# EAGLE schematic SHIELD 003 (EAGLE 9.4.1)
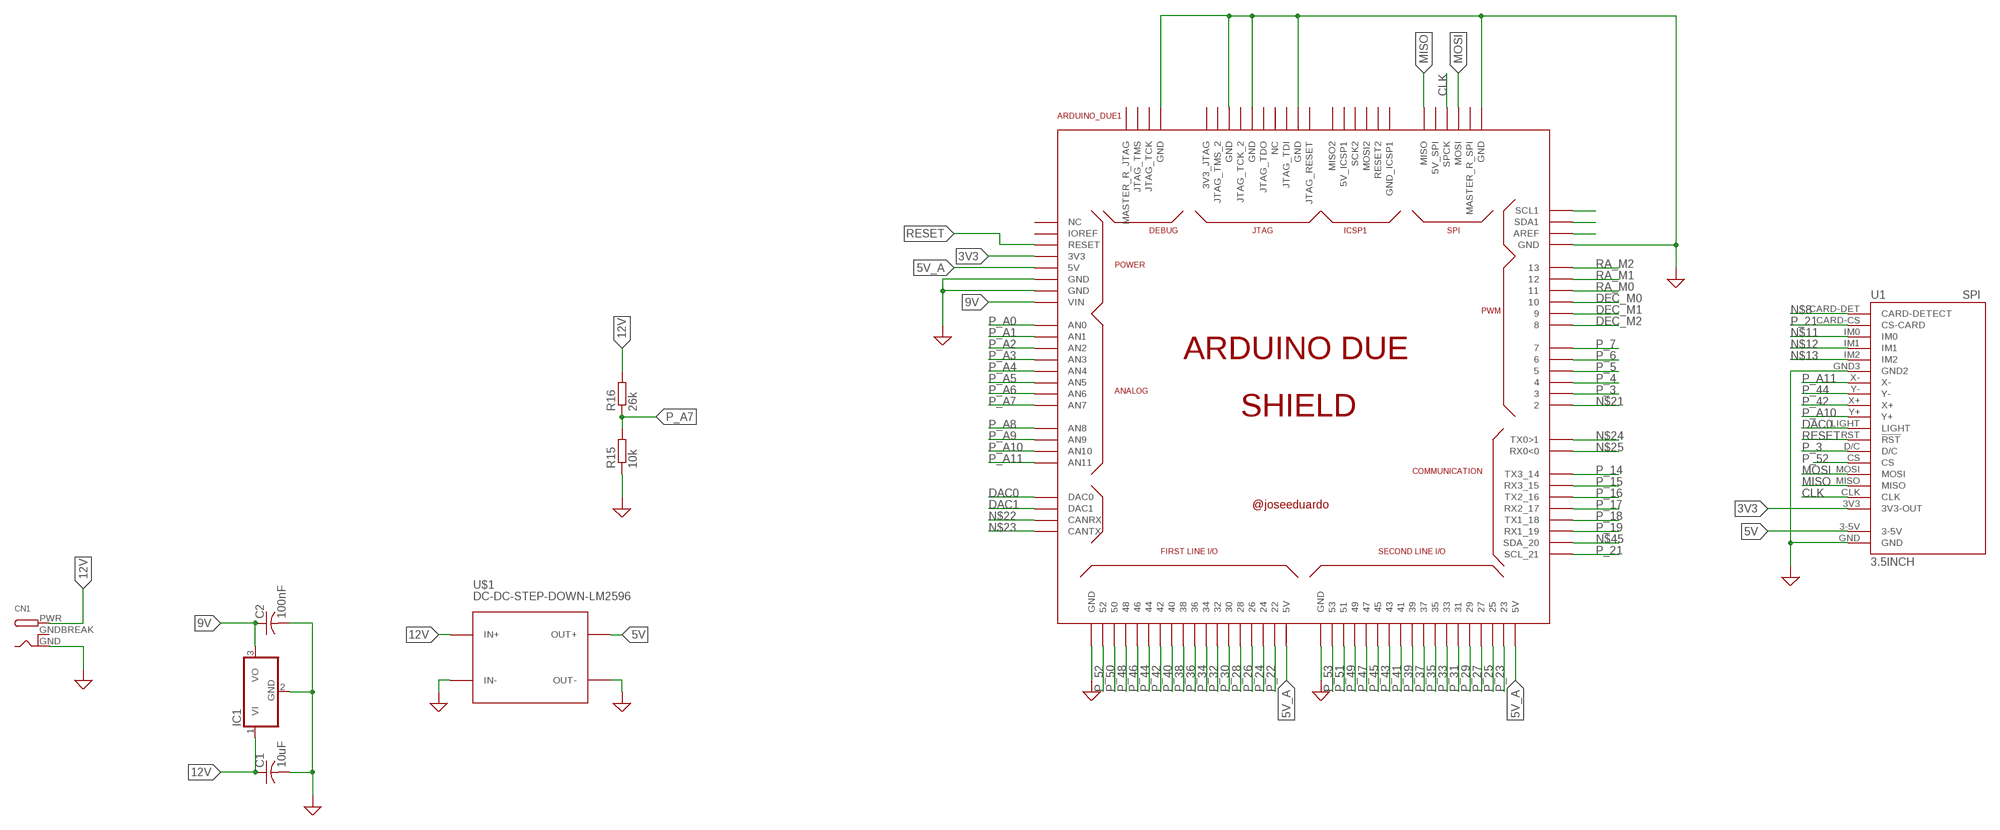
[diagram p0: schematic, sheet 1, part 1 of 3]
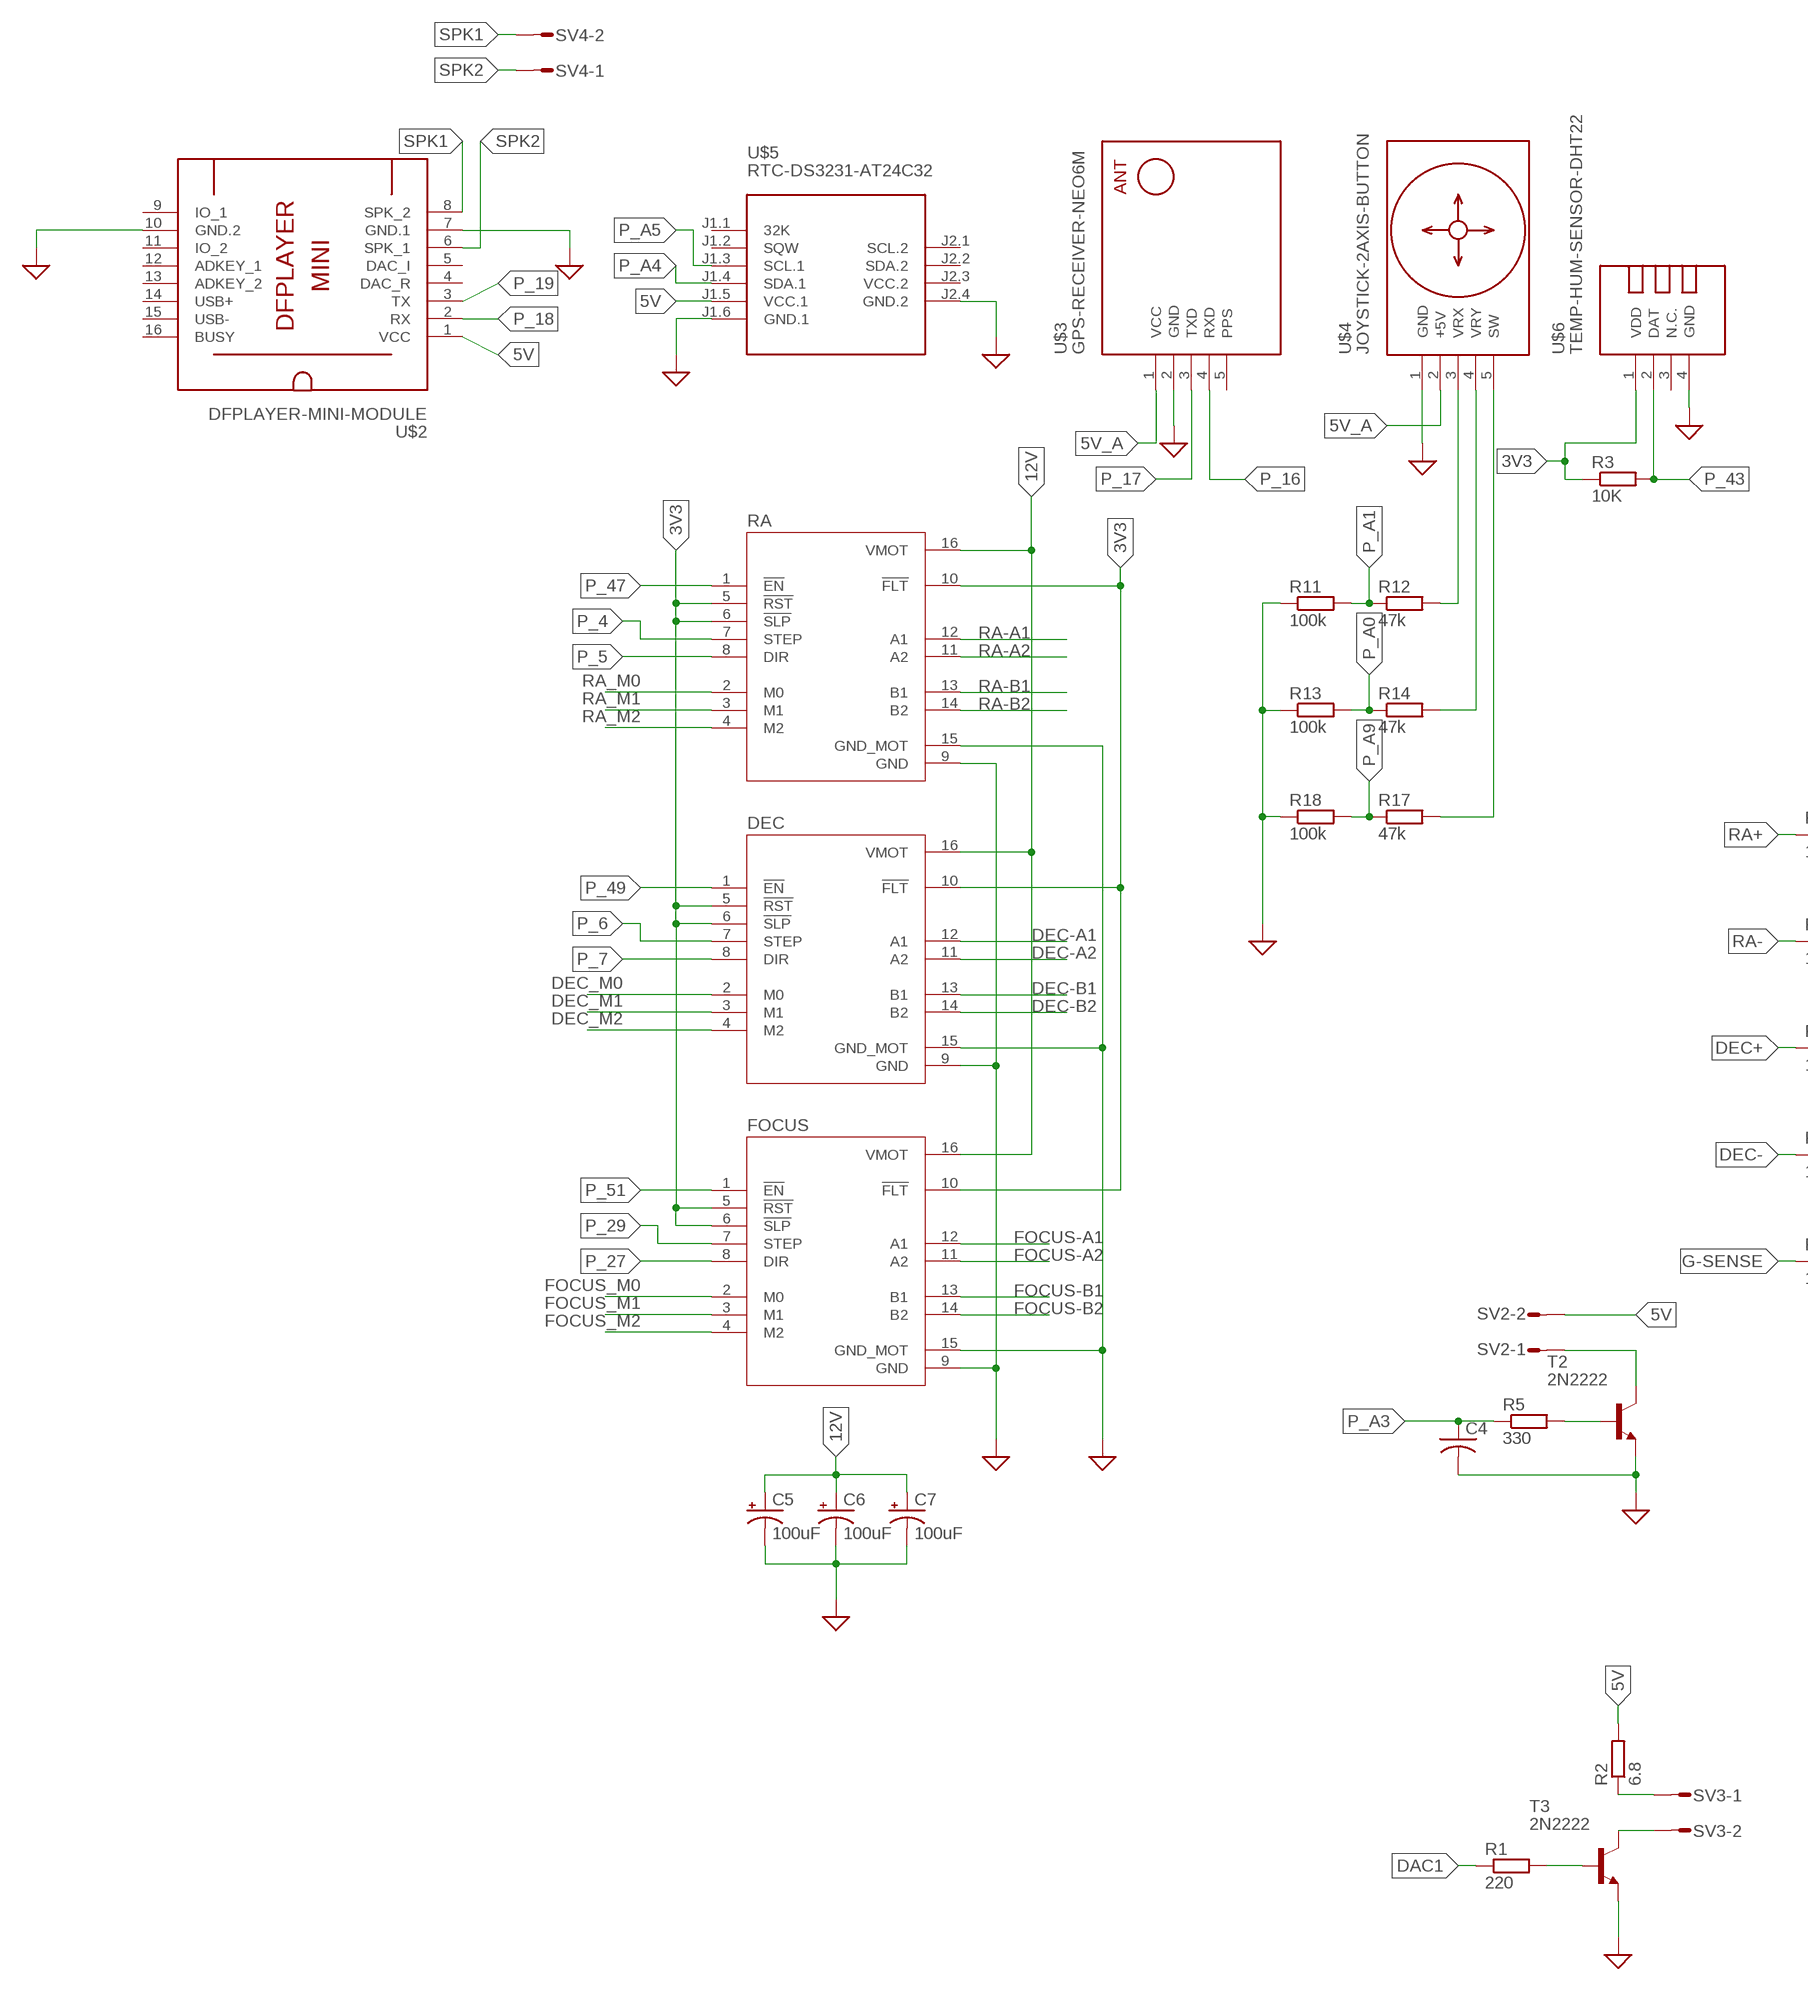
[diagram p1: schematic, sheet 1, part 2 of 3]
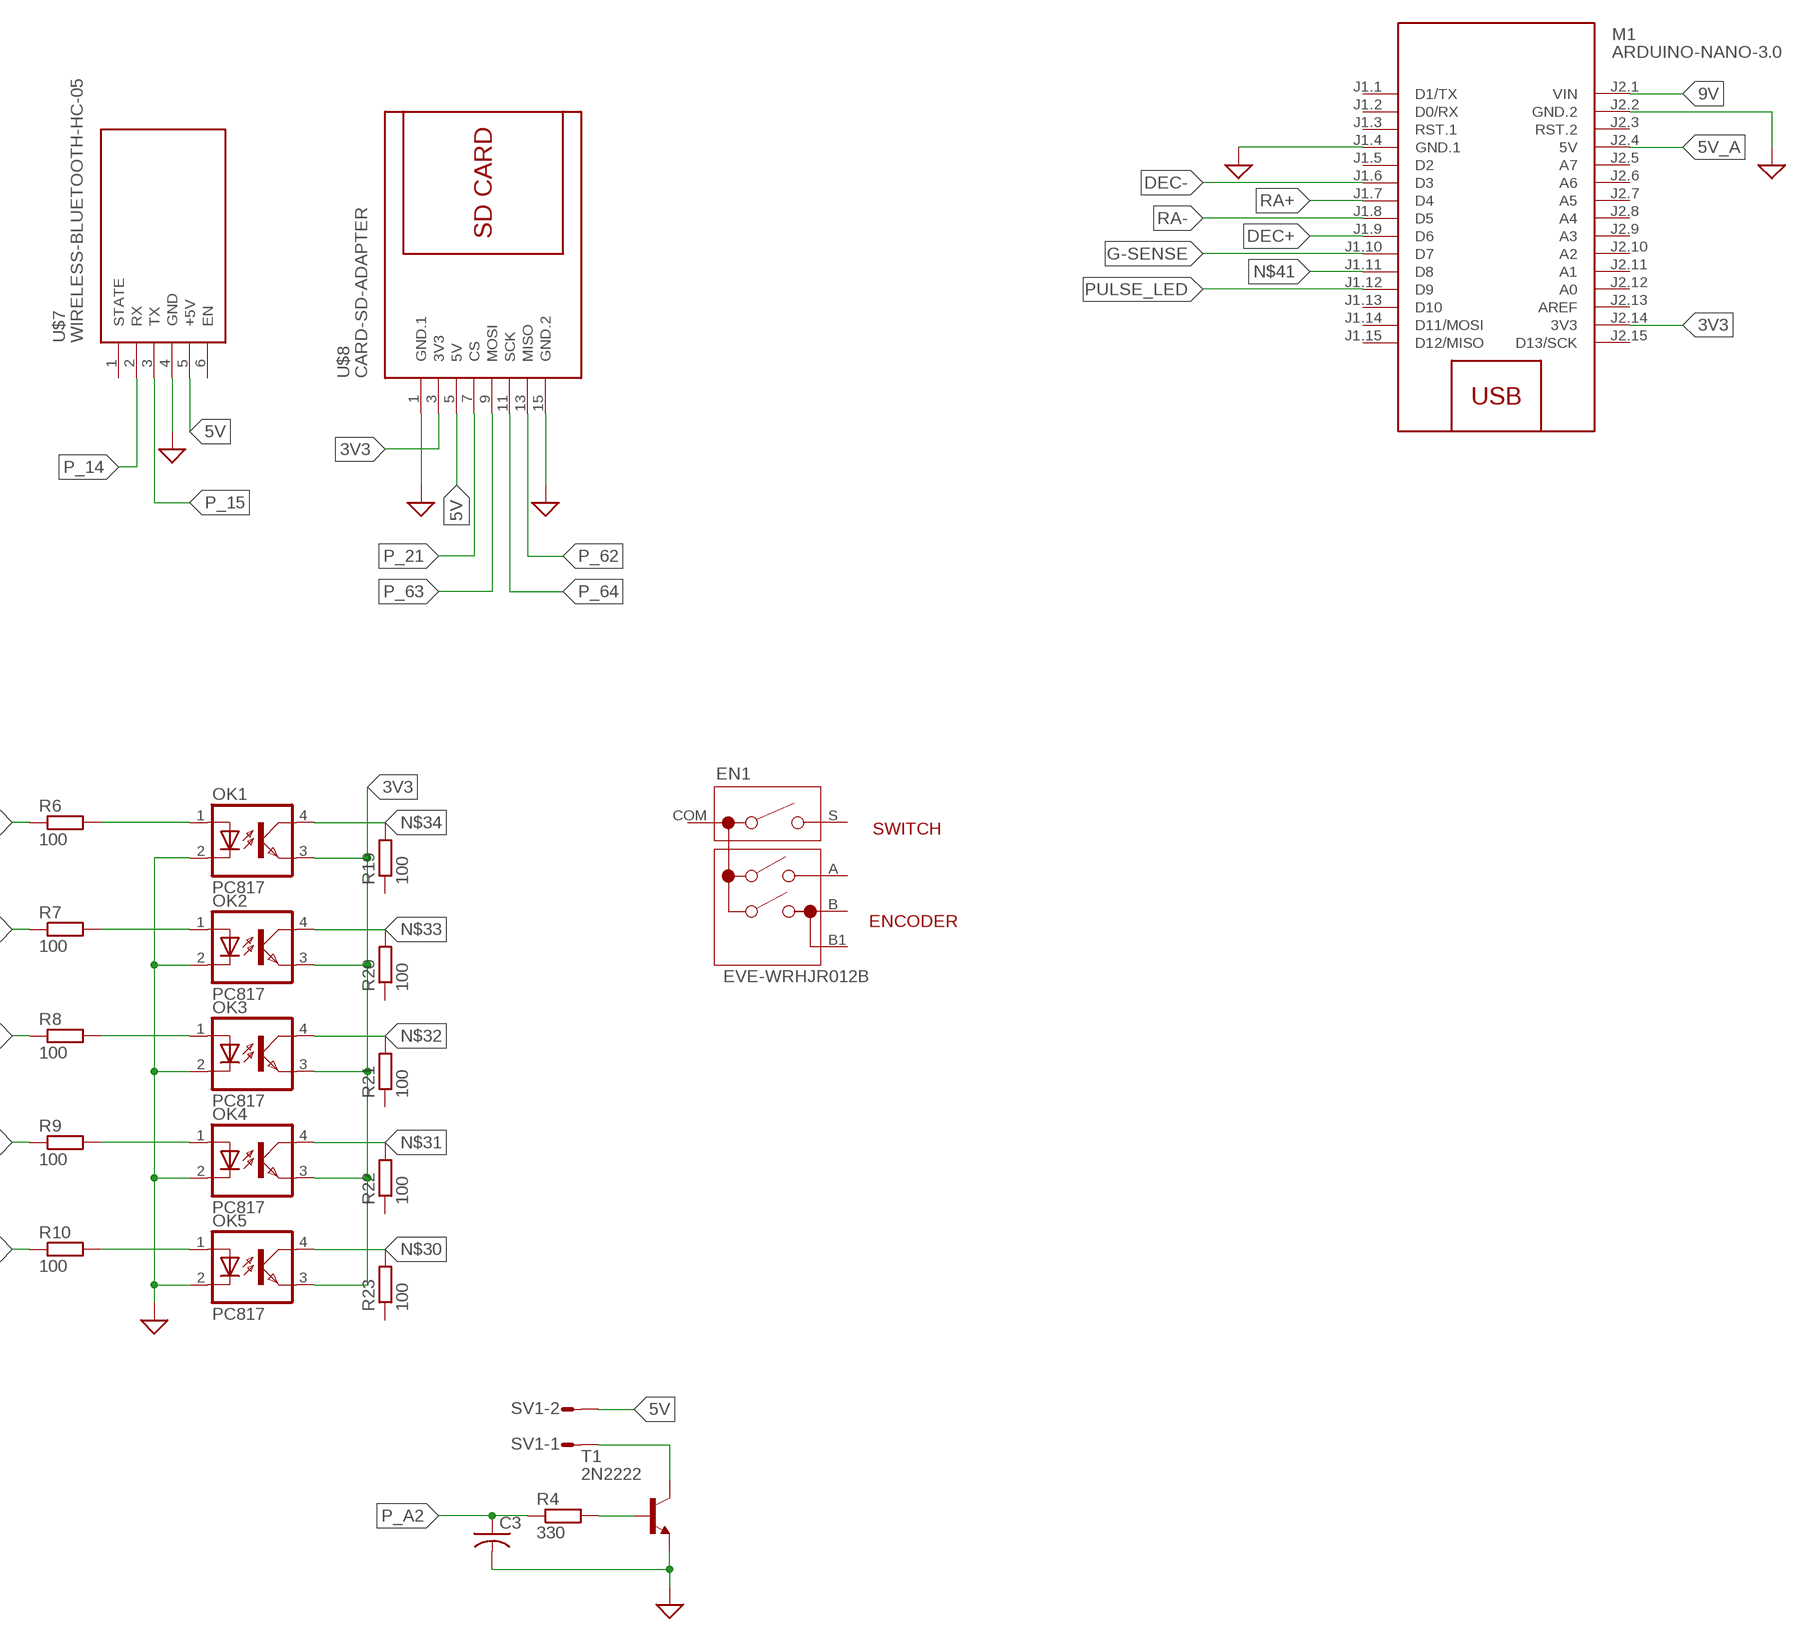
[diagram p2: schematic, sheet 1, part 3 of 3]

## Parts
ARDUINO_DUE1  ARDUINO_DUE_SHIELD  [ARDUINO_DUE_SHIELD]
C1  10uF  C-US050-025X075  [C050-025X075]
C2  100nF  C-US050-025X075  [C050-025X075]
C3  C-US050-025X075  [C050-025X075]
C4  C-US050-025X075  [C050-025X075]
C5  100uF  CAPACITOR-PE2-4  [E2-4]
C6  100uF  CAPACITOR-PE2-4  [E2-4]
C7  100uF  CAPACITOR-PE2-4  [E2-4]
CN1  DCBARRELPTH  [DCJACK_2MM_PTH]
DEC  DRV8825_STEPPER_MOTOR_DRIVER_CARRIER  [IC_DRV8825_STEPPER_MOTOR_DRIVER_CARRIER]
EN1  EVE-WRHJR012B  [EVE-WRHJR012B]
FOCUS  DRV8825_STEPPER_MOTOR_DRIVER_CARRIER  [IC_DRV8825_STEPPER_MOTOR_DRIVER_CARRIER]
IC1  7805T  [TO220H]
M1  ARDUINO-NANO-3.0  [ARDUINO-NANO-3.0]
OK1  PC817  [DIL04]
OK2  PC817  [DIL04]
OK3  PC817  [DIL04]
OK4  PC817  [DIL04]
OK5  PC817  [DIL04]
R1  220  R0207/10  [0207/10]
R2  6.8  R0207/10  [0207/10]
R3  10K  R0207/10  [0207/10]
R4  330  R0207/10  [0207/10]
R5  330  R0207/10  [0207/10]
R6  100  R0207/10  [0207/10]
R7  100  R0207/10  [0207/10]
R8  100  R0207/10  [0207/10]
R9  100  R0207/10  [0207/10]
R10  100  R0207/10  [0207/10]
R11  100k  R0207/10  [0207/10]
R12  47k  R0207/10  [0207/10]
R13  100k  R0207/10  [0207/10]
R14  47k  R0207/10  [0207/10]
R15  10k  R0207/10  [0207/10]
R16  26k  R0207/10  [0207/10]
R17  47k  R0207/10  [0207/10]
R18  100k  R0207/10  [0207/10]
R19  100  R0207/10  [0207/10]
R20  100  R0207/10  [0207/10]
R21  100  R0207/10  [0207/10]
R22  100  R0207/10  [0207/10]
R23  100  R0207/10  [0207/10]
RA  DRV8825_STEPPER_MOTOR_DRIVER_CARRIER  [IC_DRV8825_STEPPER_MOTOR_DRIVER_CARRIER]
SV1  L02P  [L02P]
SV2  L02P  [L02P]
SV3  L02P  [L02P]
SV4  L02P  [L02P]
T1  2N2222  [TO92-EBC-OVAL]
T2  2N2222  [TO92-EBC-OVAL]
T3  2N2222  [TO92-EBC-OVAL]
U1  3.5INCH  [3.5INCH]
U$1  DC-DC-STEP-DOWN-LM2596  [DC-DC-STEP-DOWN-LM2596]
U$2  DFPLAYER-MINI-MODULE  [DFPLAYER-MINI-MODULE]
U$3  GPS-RECEIVER-NEO6M  [GPS-RECEIVER-NEO6M]
U$4  JOYSTICK-2AXIS-BUTTON  [JOYSTICK-2AXIS-BUTTON]
U$5  RTC-DS3231-AT24C32  [RTC-DS3231-AT24C32]
U$6  TEMP-HUM-SENSOR-DHT22  [TEMP-HUM-SENSOR-DHT22]
U$7  WIRELESS-BLUETOOTH-HC-05  [WIRELESS-BLUETOOTH-HC-05]
U$8  CARD-SD-ADAPTER  [CARD-SD-ADAPTER]

## Nets
3V3: ARDUINO_DUE1.3V3 DEC.5(!RST) DEC.6(!SLP) DEC.10(!FLT) FOCUS.5(!RST) FOCUS.6(!SLP) FOCUS.10(!FLT) M1.J2.14(3V3) OK1.3(EMIT) OK2.3(EMIT) OK3.3(EMIT) OK4.3(EMIT) OK5.3(EMIT) R3.1 RA.5(!RST) RA.6(!SLP) RA.10(!FLT) U1.3V3(3V3-OUT) U$6.1(VDD) U$8.3(3V3)
5V: R2.2 SV1.2 SV2.2 U1.3-5V U$1.OUT+ U$2.1(VCC) U$5.J1.5(VCC.1) U$7.5(+5V) U$8.5(5V)
5V_A: ARDUINO_DUE1.5V0(5V) ARDUINO_DUE1.5V0_1(5V) ARDUINO_DUE1.5V0_2(5V) M1.J2.4(5V) U$3.1(VCC) U$4.2(+5V)
9V: ARDUINO_DUE1.VIN C2.1 IC1.3(VO) M1.J2.1(VIN)
12V: C1.1 C5.+ C6.+ C7.+ CN1.PWR DEC.16(VMOT) FOCUS.16(VMOT) IC1.1(VI) R16.2 RA.16(VMOT) U$1.IN+
CLK: ARDUINO_DUE1.SPCK U1.CLK
DAC0: ARDUINO_DUE1.DAC0 U1.LIGHT
DAC1: ARDUINO_DUE1.DAC1 R1.1
DEC+: M1.J1.9(D6) R8.1
DEC-: M1.J1.6(D3) R9.1
DEC-A1: DEC.12(A1)
DEC-A2: DEC.11(A2)
DEC-B1: DEC.13(B1)
DEC-B2: DEC.14(B2)
DEC_M0: ARDUINO_DUE1.10 DEC.2(M0)
DEC_M1: ARDUINO_DUE1.9 DEC.3(M1)
DEC_M2: ARDUINO_DUE1.8 DEC.4(M2)
FOCUS-A1: FOCUS.12(A1)
FOCUS-A2: FOCUS.11(A2)
FOCUS-B1: FOCUS.13(B1)
FOCUS-B2: FOCUS.14(B2)
FOCUS_M0: FOCUS.2(M0)
FOCUS_M1: FOCUS.3(M1)
FOCUS_M2: FOCUS.4(M2)
G-SENSE: M1.J1.10(D7) R10.1
GND: ARDUINO_DUE1.GND ARDUINO_DUE1.GND_1(GND) ARDUINO_DUE1.GND_2(GND) ARDUINO_DUE1.GND_3(GND) ARDUINO_DUE1.GND_4(GND) ARDUINO_DUE1.GND_5(GND) ARDUINO_DUE1.GND_7(GND) ARDUINO_DUE1.GND_8(GND) ARDUINO_DUE1.GND_9(GND) ARDUINO_DUE1.GND_10(GND) C1.2 C2.2 C3.2 C4.2 C5.- C6.- C7.- CN1.GND DEC.9(GND) DEC.15(GND_MOT) FOCUS.9(GND) FOCUS.15(GND_MOT) IC1.2(GND) M1.J1.4(GND.1) M1.J2.2(GND.2) OK1.2(C) OK2.2(C) OK3.2(C) OK4.2(C) OK5.2(C) R11.1 R13.1 R15.1 R18.1 RA.9(GND) RA.15(GND_MOT) T1.E T2.E T3.E U1.GND U1.GND3(GND2) U$1.IN- U$1.OUT- U$2.7(GND.1) U$2.10(GND.2) U$3.2(GND) U$4.1(GND) U$5.J1.6(GND.1) U$5.J2.4(GND.2) U$6.4(GND) U$7.4(GND) U$8.1(GND.1) U$8.15(GND.2) ; supply symbol labelled SUP
MISO: ARDUINO_DUE1.MISO U1.MISO
MOSI: ARDUINO_DUE1.MOSI U1.MOSI
N$1: R1.2 T3.B
N$2: R2.1 SV3.1
N$3: SV1.1 T1.C
N$4: R4.2 T1.B
N$5: SV3.2 T3.C
N$6: R5.2 T2.B
N$7: SV2.1 T2.C
N$8: U1.CARD-DET(CARD-DETECT)
N$9: R17.2 U$4.5(SW)
N$10: ARDUINO_DUE1.SCL1
N$11: U1.IM0
N$12: U1.IM1
N$13: U1.IM2
N$19: ARDUINO_DUE1.SDA1
N$20: ARDUINO_DUE1.AREF
N$21: ARDUINO_DUE1.2
N$22: ARDUINO_DUE1.CANRX
N$23: ARDUINO_DUE1.CANTX
N$24: ARDUINO_DUE1.1(TX0>1)
N$25: ARDUINO_DUE1.0(RX0<0)
N$30: OK5.4(COL) R23.2
N$31: OK4.4(COL) R22.2
N$32: OK3.4(COL) R21.2
N$33: OK2.4(COL) R20.2
N$34: OK1.4(COL) R19.2
N$35: OK5.1(A) R10.2
N$36: OK4.1(A) R9.2
N$37: OK3.1(A) R8.2
N$38: OK2.1(A) R7.2
N$39: OK1.1(A) R6.2
N$40: R12.2 U$4.3(VRX)
N$41: M1.J1.11(D8)
N$42: R14.2 U$4.4(VRY)
N$45: ARDUINO_DUE1.20(SDA_20)
P_3: ARDUINO_DUE1.3 U1.D/C
P_4: ARDUINO_DUE1.4 RA.7(STEP)
P_5: ARDUINO_DUE1.5 RA.8(DIR)
P_6: ARDUINO_DUE1.6 DEC.7(STEP)
P_7: ARDUINO_DUE1.7 DEC.8(DIR)
P_14: ARDUINO_DUE1.14(TX3_14) U$7.2(RX)
P_15: ARDUINO_DUE1.15(RX3_15) U$7.3(TX)
P_16: ARDUINO_DUE1.16(TX2_16) U$3.4(RXD)
P_17: ARDUINO_DUE1.17(RX2_17) U$3.3(TXD)
P_18: ARDUINO_DUE1.18(TX1_18) U$2.2(RX)
P_19: ARDUINO_DUE1.19(RX1_19) U$2.3(TX)
P_21: ARDUINO_DUE1.21(SCL_21) U1.CARD-CS(CS-CARD) U$8.7(CS)
P_22: ARDUINO_DUE1.22
P_23: ARDUINO_DUE1.23
P_24: ARDUINO_DUE1.24
P_25: ARDUINO_DUE1.25
P_26: ARDUINO_DUE1.26
P_27: ARDUINO_DUE1.27 FOCUS.8(DIR)
P_28: ARDUINO_DUE1.28
P_29: ARDUINO_DUE1.29 FOCUS.7(STEP)
P_30: ARDUINO_DUE1.30
P_31: ARDUINO_DUE1.31
P_32: ARDUINO_DUE1.32
P_33: ARDUINO_DUE1.33
P_34: ARDUINO_DUE1.34
P_35: ARDUINO_DUE1.35
P_36: ARDUINO_DUE1.36
P_37: ARDUINO_DUE1.37
P_38: ARDUINO_DUE1.38
P_39: ARDUINO_DUE1.39
P_40: ARDUINO_DUE1.40
P_41: ARDUINO_DUE1.41
P_42: ARDUINO_DUE1.42 U1.X+
P_43: ARDUINO_DUE1.43 R3.2 U$6.2(DAT)
P_44: ARDUINO_DUE1.44 U1.Y-
P_45: ARDUINO_DUE1.45
P_46: ARDUINO_DUE1.46
P_47: ARDUINO_DUE1.47 RA.1(!EN)
P_48: ARDUINO_DUE1.48
P_49: ARDUINO_DUE1.49 DEC.1(!EN)
P_50: ARDUINO_DUE1.50
P_51: ARDUINO_DUE1.51 FOCUS.1(!EN)
P_52: ARDUINO_DUE1.52 U1.CS
P_53: ARDUINO_DUE1.53
P_62: U$8.13(MISO)
P_63: U$8.9(MOSI)
P_64: U$8.11(SCK)
P_A0: ARDUINO_DUE1.A0(AN0) R13.2 R14.1
P_A1: ARDUINO_DUE1.A1(AN1) R11.2 R12.1
P_A2: ARDUINO_DUE1.A2(AN2) C3.1 R4.1
P_A3: ARDUINO_DUE1.A3(AN3) C4.1 R5.1
P_A4: ARDUINO_DUE1.A4(AN4) U$5.J1.4(SDA.1)
P_A5: ARDUINO_DUE1.A5(AN5) U$5.J1.3(SCL.1)
P_A6: ARDUINO_DUE1.A6(AN6)
P_A7: ARDUINO_DUE1.A7(AN7) R15.2 R16.1
P_A8: ARDUINO_DUE1.A8(AN8)
P_A9: ARDUINO_DUE1.A9(AN9) R17.1 R18.2
P_A10: ARDUINO_DUE1.A10(AN10) U1.Y+
P_A11: ARDUINO_DUE1.A11(AN11) U1.X-
PULSE_LED: M1.J1.12(D9)
RA+: M1.J1.7(D4) R6.1
RA-: M1.J1.8(D5) R7.1
RA-A1: RA.12(A1)
RA-A2: RA.11(A2)
RA-B1: RA.13(B1)
RA-B2: RA.14(B2)
RA_M0: ARDUINO_DUE1.11 RA.2(M0)
RA_M1: ARDUINO_DUE1.12 RA.3(M1)
RA_M2: ARDUINO_DUE1.13 RA.4(M2)
RESET: ARDUINO_DUE1.RESET U1.RST(!RST)
SPK1: SV4.2 U$2.8(SPK_2)
SPK2: SV4.1 U$2.6(SPK_1)
Unconnected: ARDUINO_DUE1.3V3_JTAG ARDUINO_DUE1.5V_2(5V_SPI) ARDUINO_DUE1.5V_ICSP1 ARDUINO_DUE1.GND_ICSP1 ARDUINO_DUE1.IOREF ARDUINO_DUE1.JTAG_RESET ARDUINO_DUE1.JTAG_TCK ARDUINO_DUE1.JTAG_TCK_2 ARDUINO_DUE1.JTAG_TDI ARDUINO_DUE1.JTAG_TDO ARDUINO_DUE1.JTAG_TMS ARDUINO_DUE1.JTAG_TMS_2 ARDUINO_DUE1.MASTER_RESET_JTAG(MASTER_R_JTAG) ARDUINO_DUE1.MASTER_RESET_SPI(MASTER_R_SPI) ARDUINO_DUE1.MISO2 ARDUINO_DUE1.MOSI2 ARDUINO_DUE1.NC_2(NC) ARDUINO_DUE1.NC_5(NC) ARDUINO_DUE1.RESET2 ARDUINO_DUE1.SCK2 EN1.A EN1.B EN1.B1 EN1.COM EN1.S M1.J1.1(D1/TX) M1.J1.2(D0/RX) M1.J1.3(RST.1) M1.J1.5(D2) M1.J1.13(D10) M1.J1.14(D11/MOSI) M1.J1.15(D12/MISO) M1.J2.3(RST.2) M1.J2.5(A7) M1.J2.6(A6) M1.J2.7(A5) M1.J2.8(A4) M1.J2.9(A3) M1.J2.10(A2) M1.J2.11(A1) M1.J2.12(A0) M1.J2.13(AREF) M1.J2.15(D13/SCK) R19.1 R20.1 R21.1 R22.1 R23.1 U$2.4(DAC_R) U$2.5(DAC_I) U$2.9(IO_1) U$2.11(IO_2) U$2.12(ADKEY_1) U$2.13(ADKEY_2) U$2.14(USB+) U$2.15(USB-) U$2.16(BUSY) U$5.J1.1(32K) U$5.J1.2(SQW) U$5.J2.1(SCL.2) U$5.J2.2(SDA.2) U$6.3(N.C.) U$7.1(STATE) U$7.6(EN)

## Power pins joined to a net without a drawn wire
GNDBREAK: CN1.GNDBREAK
PPS: U$3.5(PPS)
VCC.2: U$5.J2.3(VCC.2)

## Library data of the parts
ARDUINO_DUE1 = arduino_due_shield:ARDUINO_DUE_SHIELD
C1-C4 = adafruit:C-US: CAPACITOR, American symbol
C5-C7 = BeagleBone_Blue_R3:CAPACITOR-P: POLARIZED CAPACITOR, American symbol
CN1 = adafruit:DCBARREL: 2.0mm DC Barrel Jack DCJACK_2MM_PTH - Through Hole Jack (4UConnector: 05537)
DEC FOCUS RA = DRV8825_STEPPER_MOTOR_DRIVER_CARRIER:DRV8825_STEPPER_MOTOR_DRIVER_CARRIER: Stepper motor controler; IC: DRV8825; 1.5A; Uin mot: 8.2÷45V; AVAILABILITY: Unavailable; DESCRIPTION: Stepper, Bipolar 8.2 ~ 45VDC Supply 1.5A 8.2 ~ 45V Load; MF: Pololu; MP: DRV8825 STEPPER MOTOR DRIVER CARRIER; PACKAGE: None; PRICE: None
EN1 = Encoders:EVE-WRHJR012B: ROTARY ENCODER MECHANICAL 12PPR Manufacturer's datasheet <https://media.digikey.com/pdf/Data%20Sheets/Panasonic%20Switches%20PDFs/EVEWRHJR012B.pdf>; CREATED_BY: PCBLayout.com; DIGIKEY_PARTNO: P15917-ND; MANUFACTURER: Panasonic Electronic Components; MPN: EVE-WRHJR012B
IC1 = linear:78*: Positive VOLTAGE REGULATOR Source: http://cache.national.com/ds/LM/LM78L05.pdf http://www.fairchildsemi.com/ds/LM/LM7805.pdf
M1 = diy-modules:ARDUINO-NANO-3.0: Arduino Nano 3.0 and compatible devices More details available here: https://www.arduino.cc/en/Main/ArduinoBoardNano Click here to find device on ebay.com <http://www.ebay.com/sch/arduino+nano>
OK1-OK5 = optocoupler-3-jcn:PC817: SHARP OPTO COUPLER
R1-R23 = eagle-ltspice:R: RESISTOR, European symbol; SPICEMODEL: NONE; SPICEPREFIX: R
SV1-SV4 = con-amp-mt:L02P: AMP MT CONNECTOR; OC_FARNELL: unknown; OC_NEWARK: unknown
T1-T3 = adafruit:2N2222: NPN TRANSISTOR Big oval pads
U1 = 3.5inch display adafruit-NO8BIT:3.5INCH: Stepper motor controler; IC: DRV8825; 1.5A; Uin mot: 8.2÷45V; AVAILABILITY: Unavailable; DESCRIPTION: Stepper, Bipolar 8.2 ~ 45VDC Supply 1.5A 8.2 ~ 45V Load; MF: Pololu; MP: DRV8825 STEPPER MOTOR DRIVER CARRIER; PACKAGE: None; PRICE: None
U$1 = diy-modules:DC-DC-STEP-DOWN-LM2596: DC/DC Step-Down Regulator based on LM2596-ADJ chip LM2596 datasheet available here: http://www.ti.com/lit/ds/symlink/lm2596.pdf Click here to find device on ebay.com <http://www.ebay.com/sch/lm2596+power+regulator>
U$2 = diy-modules:DFPLAYER-MINI-MODULE: DFPlayer Mini - MP3 player module based on YX5200 chip More details available here: https://www.dfrobot.com/wiki/index.php/DFPlayer_Mini_SKU:DFR0299 Click here to find device on ebay.com <http://www.ebay.com/sch/dfplayer+mini>
U$3 = diy-modules:GPS-RECEIVER-NEO6M: GPS Receiver Module based on NEO-6 device Short tutorial how to use NEO-6 module with Arduino: http://www.xarg.org/2016/06/neo6mv2-gps-module-with-arduino/ NEO-6 datasheet is available here: https://www.u-blox.com/sites/default/files/products/documents/NEO-6_DataSheet_%28GPS.G6-HW-09005%29.pdf Click here to find device on ebay.com <http://www.ebay.com/sch/gyneo6mv2>
U$4 = diy-modules:JOYSTICK-2AXIS-BUTTON: 2-Axis Analog Joystick with Push Button Tutorial is available here: http://henrysbench.capnfatz.com/henrys-bench/arduino-sensors-and-input/arduino-ps2-joystick-tutorial-keyes-ky-023-deek-robot/ Click here to find device on ebay.com <http://www.ebay.com/sch/joystick+ps2+module>
U$5 = diy-modules:RTC-DS3231-AT24C32: RTC Module with Battery and EEPROM based on DS3231 and AT24C32 chips Tutorial can be found here: https://edwardmallon.wordpress.com/2014/05/21/using-a-cheap-3-ds3231-rtc-at24c32-eeprom-from-ebay/ Click here to find device on ebay.com <http://www.ebay.com/sch/DS3231+AT24C32+module>
U$6 = diy-modules:TEMP-HUM-SENSOR-DHT22: DHT22 - digital humidity & temperature sensor Also known as: AM2302 AM2302 datasheet available here: http://akizukidenshi.com/download/ds/aosong/AM2302.pdf Click here to find device on ebay.com <http://www.ebay.com/sch/dht22+digital+sensor>
U$7 = diy-modules:WIRELESS-BLUETOOTH-HC-05: Bluetooth Transceiver Module based on HC-05 board Tutorial is available here: https://arduino-info.wikispaces.com/BlueTooth-HC05-HC06-Modules-How-To Click here to find device on ebay.com <http://www.ebay.com/sch/hc-05+module+rs232>
U$8 = diy-modules:CARD-SD-ADAPTER: Full Size SD Card Adapter Module with onboard 3.3V regulator Guide describing how to use SD card with Arduino is available here: https://www.arduino.cc/en/Reference/SDCardNotes Click here to find device on ebay.com <http://www.ebay.com/sch/sd+card+socket+module>